# Altium schematic sheet DisplayPrint.SchDoc: DisplayPrint
size A4; Author: Jasper; DrawnBy: Jasper Maes; DocumentNumber: 5; Revision: /; SheetNumber: 5; SheetTotal: 5
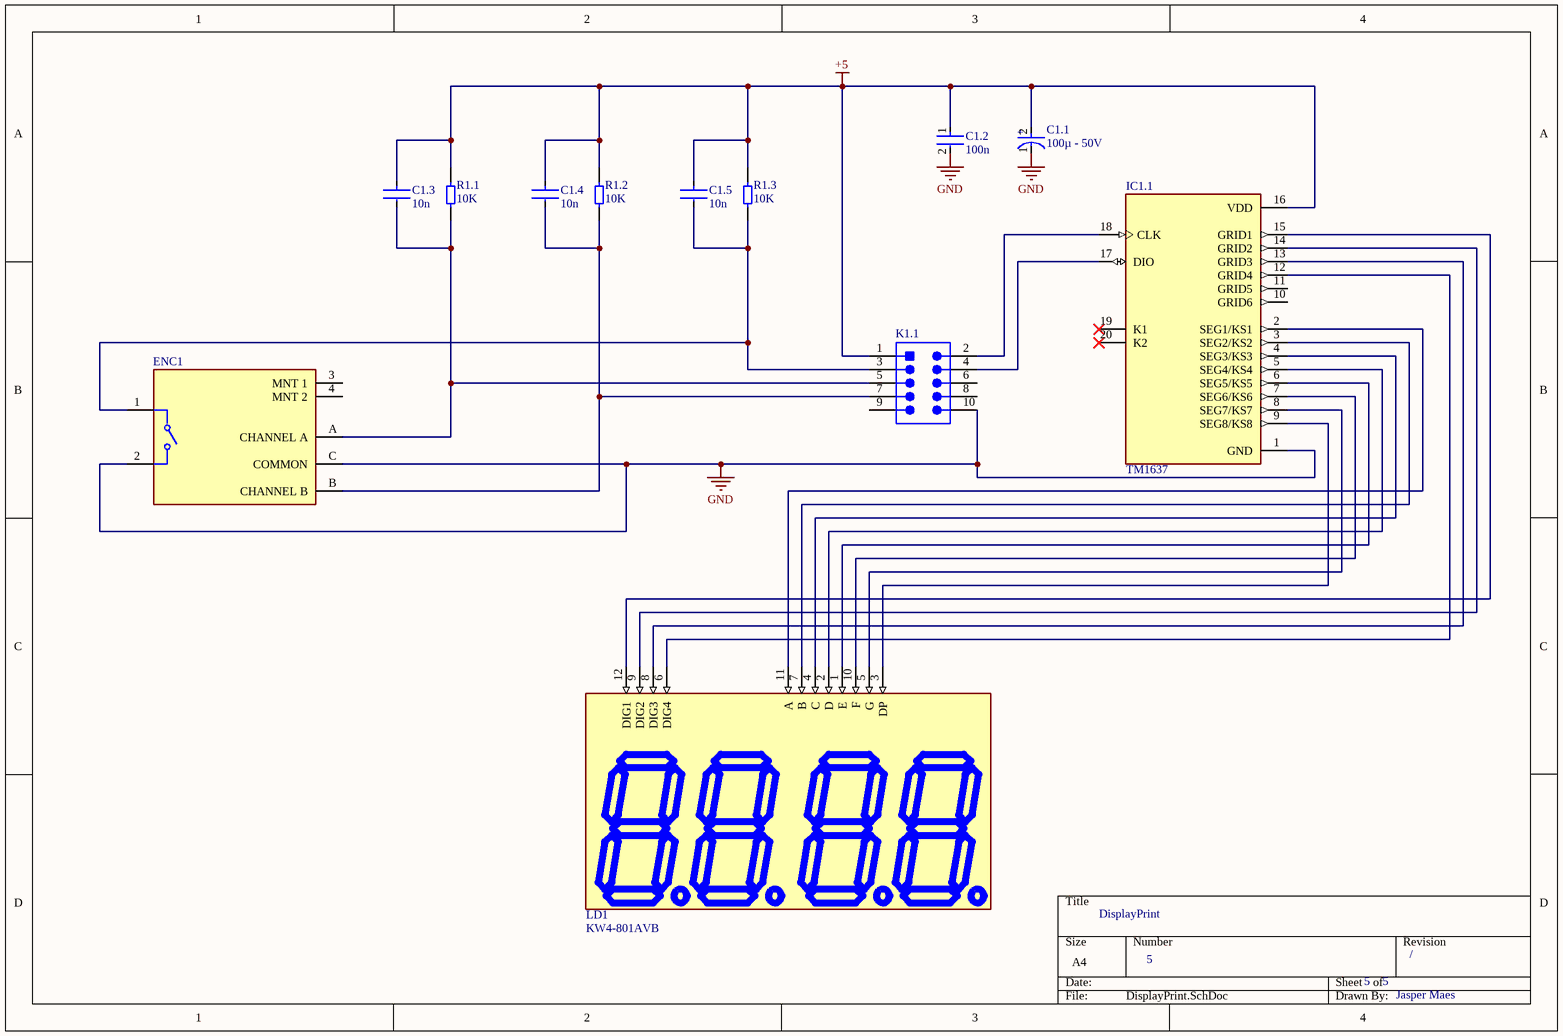
[diagram p0: DisplayPrint.SchDoc]

## Parts
C1.1  100µ - 50V  [FP-RAD-TH-D_6_3_0_5-L_11-MFG]
C1.2  100n  [FP-C0805C-DN-IPC_A]
C1.3  10n  [FP-C0805C-DN-IPC_A]
C1.4  10n  [FP-C0805C-DN-IPC_A]
C1.5  10n  [FP-C0805C-DN-IPC_A]
ENC1  PEC11R-4215F-S0024  [FP-PEC11R-4215F-S0024-MFG]  (value not drawn)
IC1.1  TM1637  [N14A]
K1.1  1-1634688-0  [TECO-1-1634688-0-10_V]  (value not drawn)
LD1  KW4-801AVB  [LEDDIG_KW4-801AVB/KW4-801CVB_LUK]
R1.1  10K  [RESC2013X60X40ML20T25]
R1.2  10K  [RESC2013X60X40ML20T25]
R1.3  10K  [RESC2013X60X40ML20T25]

## Nets
+5: C1.1.2(A) C1.2.1 C1.3.1 C1.4.1 C1.5.1 IC1.1.16(VDD) K1.1.1 R1.1.1 R1.2.1 R1.3.1
GND: C1.1.1(C) C1.2.2 ENC1.2 ENC1.C(COMMON) IC1.1.1(GND) K1.1.10
NetC1.3_2: C1.3.2 ENC1.A(CHANNEL_A) K1.1.5 R1.1.2
NetC1.4_2: C1.4.2 ENC1.B(CHANNEL_B) K1.1.7 R1.2.2
NetC1.5_2: C1.5.2 ENC1.1 K1.1.3 R1.3.2
NetIC1.1_2: IC1.1.2(SEG1/KS1) LD1.11(A)
NetIC1.1_3: IC1.1.3(SEG2/KS2) LD1.7(B)
NetIC1.1_4: IC1.1.4(SEG3/KS3) LD1.4(C)
NetIC1.1_5: IC1.1.5(SEG4/KS4) LD1.2(D)
NetIC1.1_6: IC1.1.6(SEG5/KS5) LD1.1(E)
NetIC1.1_7: IC1.1.7(SEG6/KS6) LD1.10(F)
NetIC1.1_8: IC1.1.8(SEG7/KS7) LD1.5(G)
NetIC1.1_9: IC1.1.9(SEG8/KS8) LD1.3(DP)
NetIC1.1_12: IC1.1.12(GRID4) LD1.6(DIG4)
NetIC1.1_13: IC1.1.13(GRID3) LD1.8(DIG3)
NetIC1.1_14: IC1.1.14(GRID2) LD1.9(DIG2)
NetIC1.1_15: IC1.1.15(GRID1) LD1.12(DIG1)
NetIC1.1_17: IC1.1.17(DIO) K1.1.4
NetIC1.1_18: IC1.1.18(CLK) K1.1.2

Not connected (* = marked no-connect by the designer): ENC1 3(MNT_1) 4(MNT_2); IC1.1 10(GRID6) 11(GRID5) 19(K1)* 20(K2)*; K1.1 6 8 9

## Notes on the sheet
- (in symbol CMP-05427-000897-1) +

## Library data of the parts
C1.1 = CMP-05427-000897-1: Aluminum Electrolytic Capacitors (Radial Lead Type) 100uF ±20% 25V; ESR (Equivalent Series Resistance): 130mR; Ripple Current: 455mA; Polarity: Polar; Life (Hours): 2000Hour; Lead Diameter: 0.5mm; Tolerance: 20%; Radiation Hardening: No; Min Operating Temperature: -40°C; Series: FR; Max Operating Temperature: 105°C; Lead Free: Lead Free; Package Quantity: 2000; Capacitance: 100uF; Lead Pitch: 5mm; Voltage Rating (DC): 25V; Length: 11.2mm; Features: General Purpose; Mount: Through Hole; Voltage Rating: 25V; Case/Package: Radial; Impedance: 130mR; RoHS Compliant: Yes; Packaging: Tape and Reel; Height - Seated (Max): 0.441inch; Height: 11.2mm; Diameter: 6.3mm; Termination: Radial
C1.2-C1.5 = CMP-2007-00279-2: CAP CER 0.1UF 50V X7R 0805; Manufacturer Part Number: C0805C104K5RACTU; Manufacturer: KEMET; Value: 0.10 μF; Tolerance: 0.1; Temperature Coefficient: 30ppm/°C; Material: Ceramic; Device Class L2: Capacitors; Temperature Range Low: -55°C; Voltage Rating: 50 V; Digikey Description: CAP CER 0.1UF 50V X7R 0805; Category: Cap; ComponentLink2Description: Datasheet; Octopart: https://octopart.com/c0805c104k5ractu-kemet-143926; RoHS: TRUE; ComponentLink2URL: https://content.kemet.com/datasheets/KEM_C1003_C0G_SMD.pdf; Temperature Characteristic: X7R; Temperature: -55°C to +125°C; Height: 0.88mm; Temperature Range High: +125°C; Device Class L1: Passive Components; Automotive: No; Lead Free: Yes; Ipc Land Pattern Name: CAPC200125X78; Device Class L3: Ceramic Capacitors; Mouser Description: Cap Ceramic 0.1uF 50V X7R 10% SMD 2.0 x 1.2 mm 125 C Paper T/R; Capacitance: 0.10 μF; Package: C0805C-DN
ENC1 = CMP-1747-00012-2: ROTARY ENCODER MECHANICAL 24PPR; Hole Diameter: 1.8mm; Output Type: Quadrature; Pulses per Revolution: 24; Number of Channels: 2; Built in Switch: Yes; Min Operating Temperature: -30°C; Series: PEC11R; Type: Mechanical; Package Quantity: 150; Length: 21.5mm; Max Operating Temperature: 70°C; Encoder Type: Mechanical; Height: 13.4mm; Detent: Yes; Packaging: Bulk; Orientation: Vertical; Width: 12.5mm; Termination: PC Pins; Mount: Through Hole; REACH SVHC: No SVHC; Radiation Hardening: No; RoHS Compliant: Yes
IC1.1 = TM1637: LED Drive Control Special Circuit; MF: Titan Micro Electronics; Package: Package; Availability: Not in stock; SnapEDA_Link: https://www.snapeda.com/parts/TM1637/Titan+Micro+Electronics/view-part/?ref=snap; MP: TM1637; Check_prices: https://www.snapeda.com/parts/TM1637/Titan+Micro+Electronics/view-part/?ref=eda; Value: *; Price: None
K1.1 = CMP-2000-05854-1: Male Header, Pitch 2.54 mm, 2 x 5 Postion, Height 9.15 mm, Tail Length 3.2 mm, -40 to 105 degC, RoHS, Bulk; Manufacturer: TE Connectivity; No. of Rows: 2; SVHC: ToBeAdvised; Package Version: Rev. C2, 02/2011; No. of Contacts: 10Contacts; Pitch: 2.54mm; No. of Positions: 10; Contact Termination Type: ThroughHole; Package Description: 10-Pin Connector, Body 20.35 x 8.7 mm, Pitch 2.54 mm; Orientation: Straight; Gender: Header; Mounting Technology: ThroughHole; Product Range: -; PartNumber: 1-1634688-0; Datasheet Version: Rev. C2, 02/2011; Contact Material: Brass; Package URL: https://datasheet.ciiva.com/6831/eng-cd-1634688-c2-6831201.pdf; Package Reference: 1-1634688-0; Pitch Spacing: 2.54mm; Contact Plating: GoldPlatedContacts; Manufacturer URL: http://www.te.com/; Datasheet URL: https://datasheet.ciiva.com/6831/eng-cd-1634688-c2-6831201.pdf
LD1 = LDQ-M3604RI: Display, Seven Segment, 9.2MM, Red; MF: Lumex; MP: LDQ-M3604RI; Value: *; Check_prices: https://www.snapeda.com/parts/LDQ-M3604RI/Lumex/view-part/?ref=eda; Package: None; Price: None; Availability: In Stock; SnapEDA_Link: https://www.snapeda.com/parts/LDQ-M3604RI/Lumex/view-part/?ref=snap
R1.1-R1.3 = CMP-2001-00629-1_1: Part Number: ERA6AEB332V; Manufacturer: Panasonic